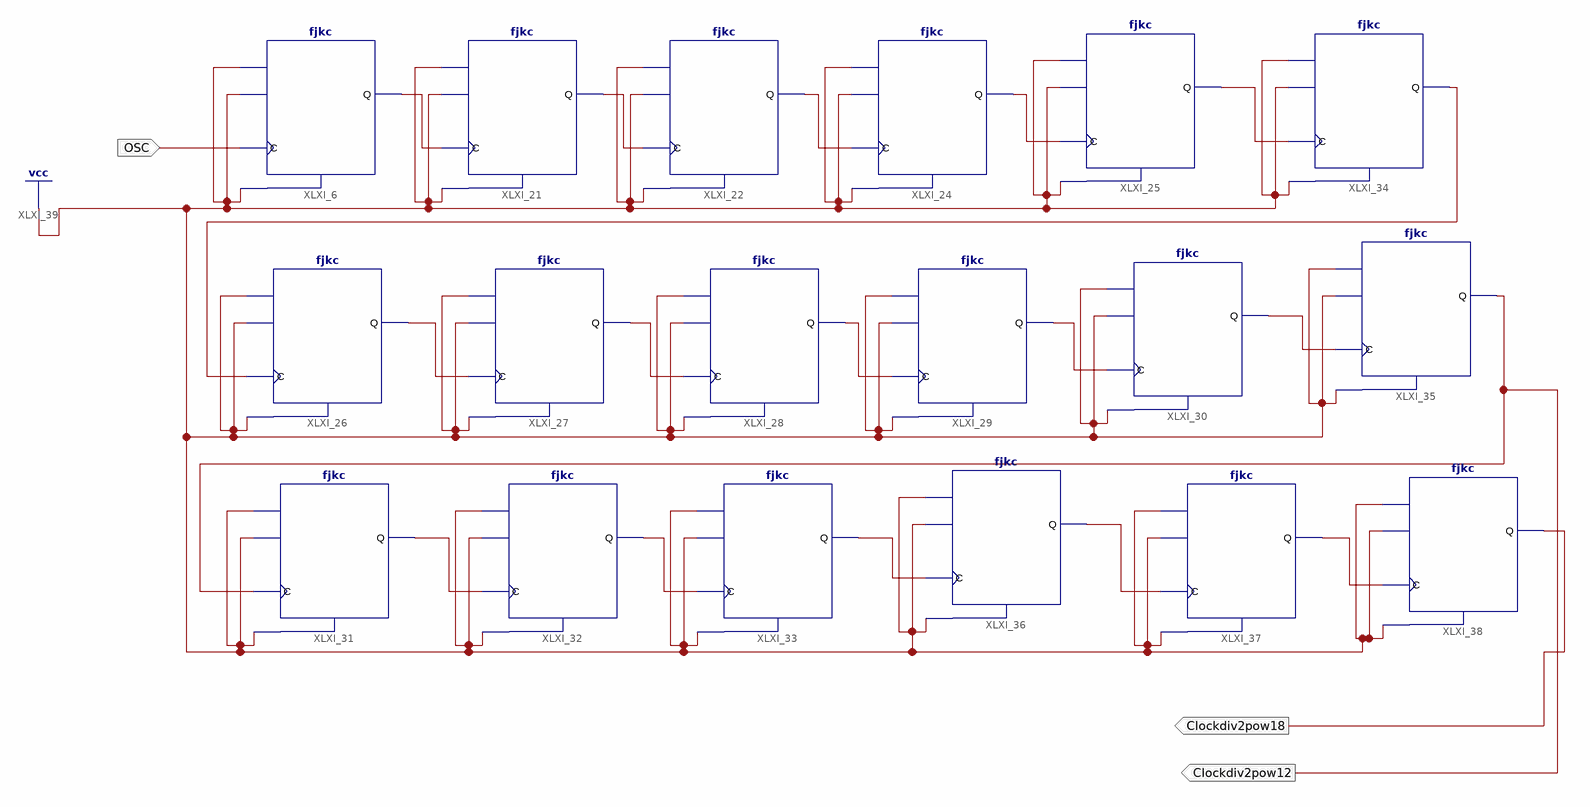
[diagram p0: schematic sheet 1]
// Xilinx ISE schematic clockDiv.sch (spartan6) as structural Verilog: 18 symbols, 3 ports
module clockDiv (
  input  OSC,
  output Clockdiv2pow12,
  output Clockdiv2pow18
);

  wire XLXN_107, XLXN_108, XLXN_109, XLXN_110, XLXN_121, XLXN_124, XLXN_126, XLXN_127, XLXN_128, XLXN_129,
       XLXN_130, XLXN_133, XLXN_134, XLXN_137, XLXN_138, XLXN_139;

  fjkc XLXI_21 (.C(XLXN_107), .CLR(1'b1), .J(1'b1), .K(1'b1), .Q(XLXN_108));
  fjkc XLXI_22 (.C(XLXN_108), .CLR(1'b1), .J(1'b1), .K(1'b1), .Q(XLXN_109));
  fjkc XLXI_24 (.C(XLXN_109), .CLR(1'b1), .J(1'b1), .K(1'b1), .Q(XLXN_110));
  fjkc XLXI_25 (.C(XLXN_110), .CLR(1'b1), .J(1'b1), .K(1'b1), .Q(XLXN_121));
  fjkc XLXI_26 (.C(XLXN_124), .CLR(1'b1), .J(1'b1), .K(1'b1), .Q(XLXN_126));
  fjkc XLXI_27 (.C(XLXN_126), .CLR(1'b1), .J(1'b1), .K(1'b1), .Q(XLXN_127));
  fjkc XLXI_28 (.C(XLXN_127), .CLR(1'b1), .J(1'b1), .K(1'b1), .Q(XLXN_128));
  fjkc XLXI_29 (.C(XLXN_128), .CLR(1'b1), .J(1'b1), .K(1'b1), .Q(XLXN_129));
  fjkc XLXI_30 (.C(XLXN_129), .CLR(1'b1), .J(1'b1), .K(1'b1), .Q(XLXN_130));
  fjkc XLXI_31 (.C(Clockdiv2pow12), .CLR(1'b1), .J(1'b1), .K(1'b1), .Q(XLXN_133));
  fjkc XLXI_32 (.C(XLXN_133), .CLR(1'b1), .J(1'b1), .K(1'b1), .Q(XLXN_134));
  fjkc XLXI_33 (.C(XLXN_134), .CLR(1'b1), .J(1'b1), .K(1'b1), .Q(XLXN_137));
  fjkc XLXI_6 (.C(OSC), .CLR(1'b1), .J(1'b1), .K(1'b1), .Q(XLXN_107));
  fjkc XLXI_34 (.C(XLXN_121), .CLR(1'b1), .J(1'b1), .K(1'b1), .Q(XLXN_124));
  fjkc XLXI_36 (.C(XLXN_137), .CLR(1'b1), .J(1'b1), .K(1'b1), .Q(XLXN_138));
  fjkc XLXI_37 (.C(XLXN_138), .CLR(1'b1), .J(1'b1), .K(1'b1), .Q(XLXN_139));
  fjkc XLXI_38 (.C(XLXN_139), .CLR(1'b1), .J(1'b1), .K(1'b1), .Q(Clockdiv2pow18));
  fjkc XLXI_35 (.C(XLXN_130), .CLR(1'b1), .J(1'b1), .K(1'b1), .Q(Clockdiv2pow12));
endmodule
